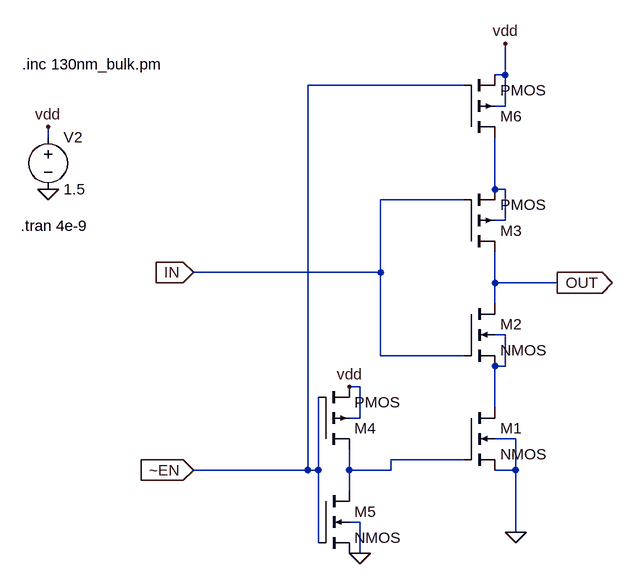
[diagram p0: schematic three_state.asc]
three_state.asc, the LTspice schematic file:
Version 4
SHEET 1 880 680
WIRE 48 -448 48 -496
WIRE 48 -448 32 -448
WIRE -16 -432 -256 -432
WIRE 48 -400 48 -448
WIRE 48 -400 32 -400
WIRE -656 -352 -656 -368
WIRE 32 -272 32 -352
WIRE 48 -272 32 -272
WIRE -16 -256 -144 -256
WIRE 48 -224 48 -272
WIRE 48 -224 32 -224
WIRE -144 -144 -144 -256
WIRE -144 -144 -432 -144
WIRE 32 -128 32 -176
WIRE 128 -128 32 -128
WIRE 32 -96 32 -128
WIRE 48 -48 32 -48
WIRE -144 -16 -144 -144
WIRE -16 -16 -144 -16
WIRE 48 0 48 -48
WIRE 48 0 32 0
WIRE -176 32 -192 32
WIRE 32 64 32 0
WIRE -176 80 -176 32
WIRE -176 80 -192 80
WIRE 64 112 32 112
WIRE -16 144 -128 144
WIRE -256 160 -256 -432
WIRE -256 160 -432 160
WIRE -240 160 -240 48
WIRE -240 160 -256 160
WIRE -192 160 -192 128
WIRE -128 160 -128 144
WIRE -128 160 -192 160
WIRE 64 160 64 112
WIRE 64 160 32 160
WIRE -192 192 -192 160
WIRE -176 240 -192 240
WIRE 64 256 64 160
WIRE -240 272 -240 160
WIRE -176 288 -176 240
WIRE -176 288 -192 288
FLAG -656 -368 vdd
FLAG -656 -272 0
FLAG -176 288 0
FLAG -192 32 vdd
FLAG 48 -496 vdd
FLAG 64 256 0
FLAG -432 -144 IN
IOPIN -432 -144 In
FLAG -432 160 ~EN
IOPIN -432 160 In
FLAG 128 -128 OUT
IOPIN 128 -128 Out
SYMBOL voltage -656 -368 R0
WINDOW 123 0 0 Left 0
WINDOW 39 0 0 Left 0
SYMATTR InstName V2
SYMATTR Value 1.5
SYMBOL pmos4 -240 128 M180
SYMATTR InstName M4
SYMATTR Value2 l=130e-9 w=2600e-9 ad=676000e-18 as=676000e-18 pd=3640e-9 ps=3640e-9
SYMBOL nmos4 -240 192 R0
SYMATTR InstName M5
SYMATTR Value2 l=130e-9 w=1300e-9 ad=676000e-18 as=676000e-18 pd=3640e-9 ps=3640e-9
SYMBOL nmos4 -16 64 R0
SYMATTR InstName M1
SYMATTR Value2 l=130e-9 w=1300e-9 ad=676000e-18 as=676000e-18 pd=3640e-9 ps=3640e-9
SYMBOL nmos4 -16 -96 R0
SYMATTR InstName M2
SYMATTR Value2 l=130e-9 w=1300e-9 ad=676000e-18 as=676000e-18 pd=3640e-9 ps=3640e-9
SYMBOL pmos4 -16 -176 M180
SYMATTR InstName M3
SYMATTR Value2 l=130e-9 w=2600e-9 ad=676000e-18 as=676000e-18 pd=3640e-9 ps=3640e-9
SYMBOL pmos4 -16 -352 M180
SYMATTR InstName M6
SYMATTR Value2 l=130e-9 w=2600e-9 ad=676000e-18 as=676000e-18 pd=3640e-9 ps=3640e-9
TEXT -696 -464 Left 2 !.inc 130nm_bulk.pm
TEXT -698 -216 Left 2 !.tran 4e-9

The netlist it stands for:
* three_state.asc
V2 vdd 0 1.5
M4 N003 ~EN vdd vdd PMOS l=130e-9 w=2600e-9 ad=676000e-18 as=676000e-18 pd=3640e-9 ps=3640e-9
M5 N003 ~EN 0 0 NMOS l=130e-9 w=1300e-9 ad=676000e-18 as=676000e-18 pd=3640e-9 ps=3640e-9
M1 N002 N003 0 0 NMOS l=130e-9 w=1300e-9 ad=676000e-18 as=676000e-18 pd=3640e-9 ps=3640e-9
M2 OUT IN N002 N002 NMOS l=130e-9 w=1300e-9 ad=676000e-18 as=676000e-18 pd=3640e-9 ps=3640e-9
M3 OUT IN N001 N001 PMOS l=130e-9 w=2600e-9 ad=676000e-18 as=676000e-18 pd=3640e-9 ps=3640e-9
M6 N001 ~EN vdd vdd PMOS l=130e-9 w=2600e-9 ad=676000e-18 as=676000e-18 pd=3640e-9 ps=3640e-9
.model NMOS NMOS
.model PMOS PMOS
.lib standard.mos
.inc 130nm_bulk.pm
.tran 4e-9
.backanno
.end